# EAGLE design arcade_controls (EAGLE 6.4)
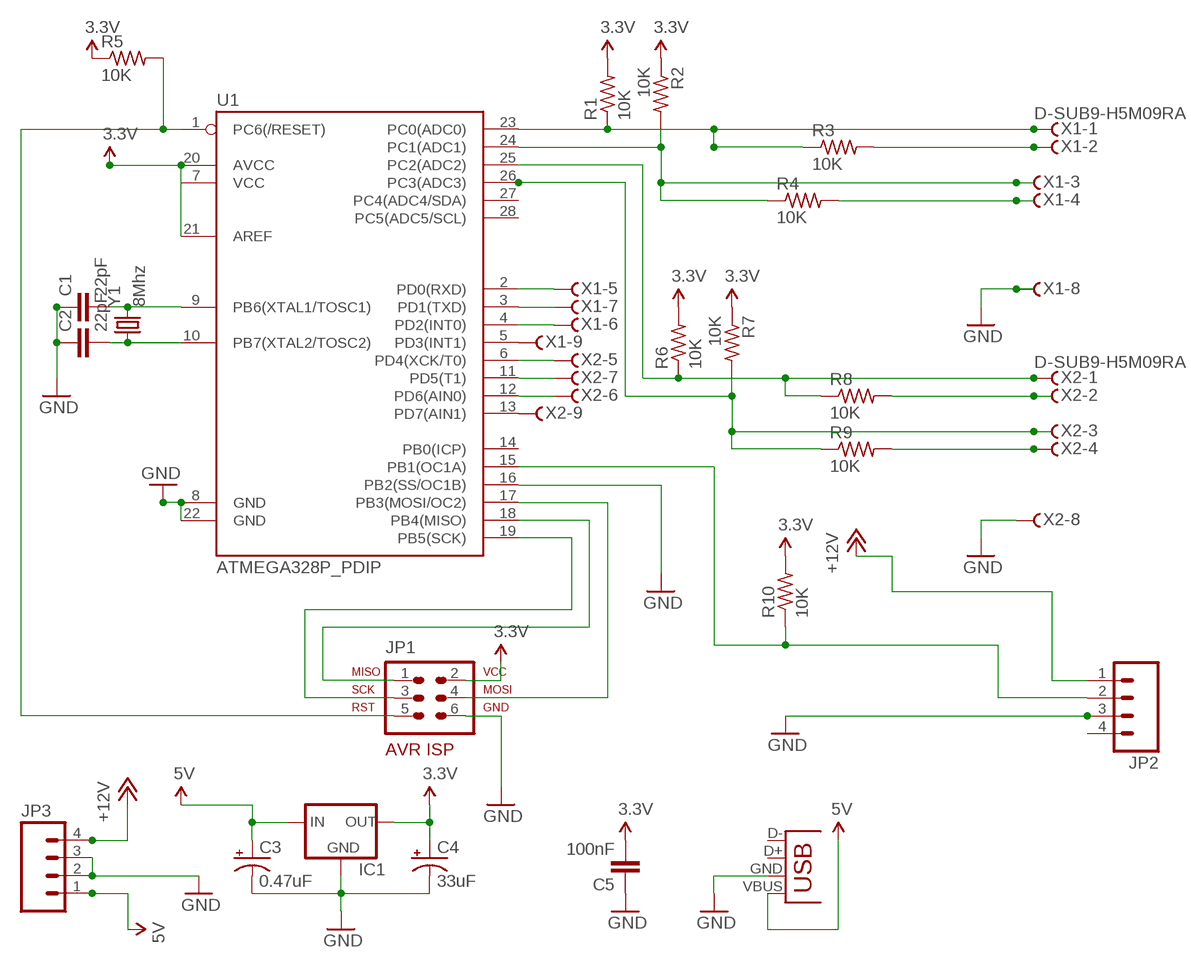
[diagram p0: schematic, sheet 1]

## Parts
C1  22pF  CAPPTH  [CAP-PTH-SMALL]
C2  22pF  CAPPTH  [CAP-PTH-SMALL]
C3  0.47uF  CAP_POLPTH2  [CPOL-RADIAL-10UF-25V]
C4  33uF  CAP_POLPTH2  [CPOL-RADIAL-10UF-25V]
C5  100nF  CAPPTH  [CAP-PTH-SMALL]
IC1  V_REG_78XXSIDE  [78XXL]
JP1  AVR-ISP-6VERT  [AVR-ISP-6]
JP2  M04LOCK  [1X04_LOCK]
JP3  M04LOCK  [1X04_LOCK]
JP4  USB-A-H  [USB-A-H]
R1  10K  R-US_0309/12  [0309/12]
R2  10K  R-US_0309/12  [0309/12]
R3  10K  R-US_0309/12  [0309/12]
R4  10K  R-US_0309/12  [0309/12]
R5  10K  R-US_0309/12  [0309/12]
R6  10K  R-US_0309/12  [0309/12]
R7  10K  R-US_0309/12  [0309/12]
R8  10K  R-US_0309/12  [0309/12]
R9  10K  R-US_0309/12  [0309/12]
R10  10K  R-US_0309/12  [0309/12]
U1  ATMEGA328P_PDIP  [DIL28-3]
X1  D-SUB9-H5M09RA  [H5M09RA]
X2  D-SUB9-H5M09RA  [H5M09RA]
Y1  8Mhz  CRYSTALHC49UV  [HC49U-V]

## Nets
3.3V: C4.1(+) C5.2 IC1.OUT JP1.2 R1.2 R2.1 R5.1 R6.2 R7.1 R10.2 U1.7(VCC) U1.20(AVCC) U1.21(AREF)
5V: C3.1(+) IC1.IN JP3.1 JP4.VBUS(GND)
+12V: JP2.1 JP3.4
GND: C1.1 C2.1 C3.2(-) C4.2(-) C5.1 IC1.GND JP1.6 JP2.3 JP3.2 JP3.3 JP4.GND(VBUS) U1.8(GND) U1.16(PB2(SS/OC1B)) U1.22(GND) X1.8 X2.8
N$1: R1.1 R3.1 U1.23(PC0(ADC0)) X1.1
N$2: U1.12(PD6(AIN0)) X2.6
N$3: JP1.5 R5.2 U1.1(PC6(/RESET))
N$4: R2.2 R4.1 U1.24(PC1(ADC1)) X1.3
N$5: JP1.3 U1.19(PB5(SCK))
N$6: JP1.1 U1.18(PB4(MISO))
N$7: JP1.4 U1.17(PB3(MOSI/OC2))
N$8: U1.13(PD7(AIN1)) X2.9
N$9: C2.2 U1.10(PB7(XTAL2/TOSC2)) Y1.1
N$10: JP2.2 R10.1 U1.15(PB1(OC1A))
N$11: U1.11(PD5(T1)) X2.7
N$12: R3.2 X1.2
N$13: R4.2 X1.4
N$14: U1.3(PD1(TXD)) X1.7
N$15: R7.2 R9.1 U1.26(PC3(ADC3)) X2.3
N$16: C1.2 U1.9(PB6(XTAL1/TOSC1)) Y1.2
N$17: R6.1 R8.1 U1.25(PC2(ADC2)) X2.1
N$18: R8.2 X2.2
N$19: R9.2 X2.4
N$20: U1.2(PD0(RXD)) X1.5
N$21: U1.4(PD2(INT0)) X1.6
N$23: U1.5(PD3(INT1)) X1.9
N$24: U1.6(PD4(XCK/T0)) X2.5
Unconnected: JP2.4 JP4.D+(D-) JP4.D-(D+) U1.14(PB0(ICP)) U1.27(PC4(ADC4/SDA)) U1.28(PC5(ADC5/SCL))

## Library data of the parts
C1 C2 C5 = SparkFun-Capacitors:CAP: Capacitor Standard 0603 ceramic capacitor, and 0.1" leaded capacitor.
C3 C4 = SparkFun-Capacitors:CAP_POL: Capacitor Polarized These are standard SMD and PTH capacitors. Normally 10uF, 47uF, and 100uF in electrolytic and tantalum varieties. Always verify the external diameter of the through hole cap, it varies with capacity, voltage, and manufacturer. The EIA devices should be standard.
IC1 = SparkFun-PowerIC:V_REG_78XX: Voltage Regulator Standard 7805 5V regulator. IGO (Input Ground Output). Spark Fun Electronics SKU : COM-00107
JP1 = avr-7:AVR-ISP-6: AVR ISP-6 Serial Programming Header
JP2 JP3 = SparkFun-Connectors:M04: Header 4 Standard 4-pin 0.1" header. Use with straight break away headers (SKU : PRT-00116), right angle break away headers (PRT-00553), swiss pins (PRT-00743), machine pins (PRT-00117), and female headers (PRT-00115). Molex polarized connector foot print use with SKU : PRT-08231 with associated crimp pins and housings. 1MM SMD Version SKU: PRT-10208
JP4 = SparkFun-Connectors:USB: USB Connectors USB-B-PTH is fully proven SKU : PRT-00139/CONN-08278 USB-miniB is fully proven SKU : PRT-00587 USB-A-PCB is untested. USB-A-H is throughly reviewed, but untested. Spark Fun Electronics SKU : PRT-00437 USB-B-SMT is throughly reviewed, but untested. Needs silkscreen touching up. USB-A-S has not been used/tested USB-MB-H has not been used/tested USB-MICROB has been used. CONN-09505
R1-R10 = resistor:R-US_: RESISTOR, American symbol
U1 = SparkFun-DigitalIC:ATMEGA328P_PDIP: uC used in the Arduino 32kb flash, 1k EEPROM, 2k SRAM This is the through-hole version of this chip.
X1 X2 = con-thomas-betts:D-SUB9-: D-Subminiatur Connector Source: Electronioc Interconnects European Edition 1998; OC_FARNELL: unknown; OC_NEWARK: unknown
Y1 = SparkFun-FreqCtrl:CRYSTAL: Various standard crystals. Proven footprints. Spark Fun Electronics SKU : COM-00534

## Board
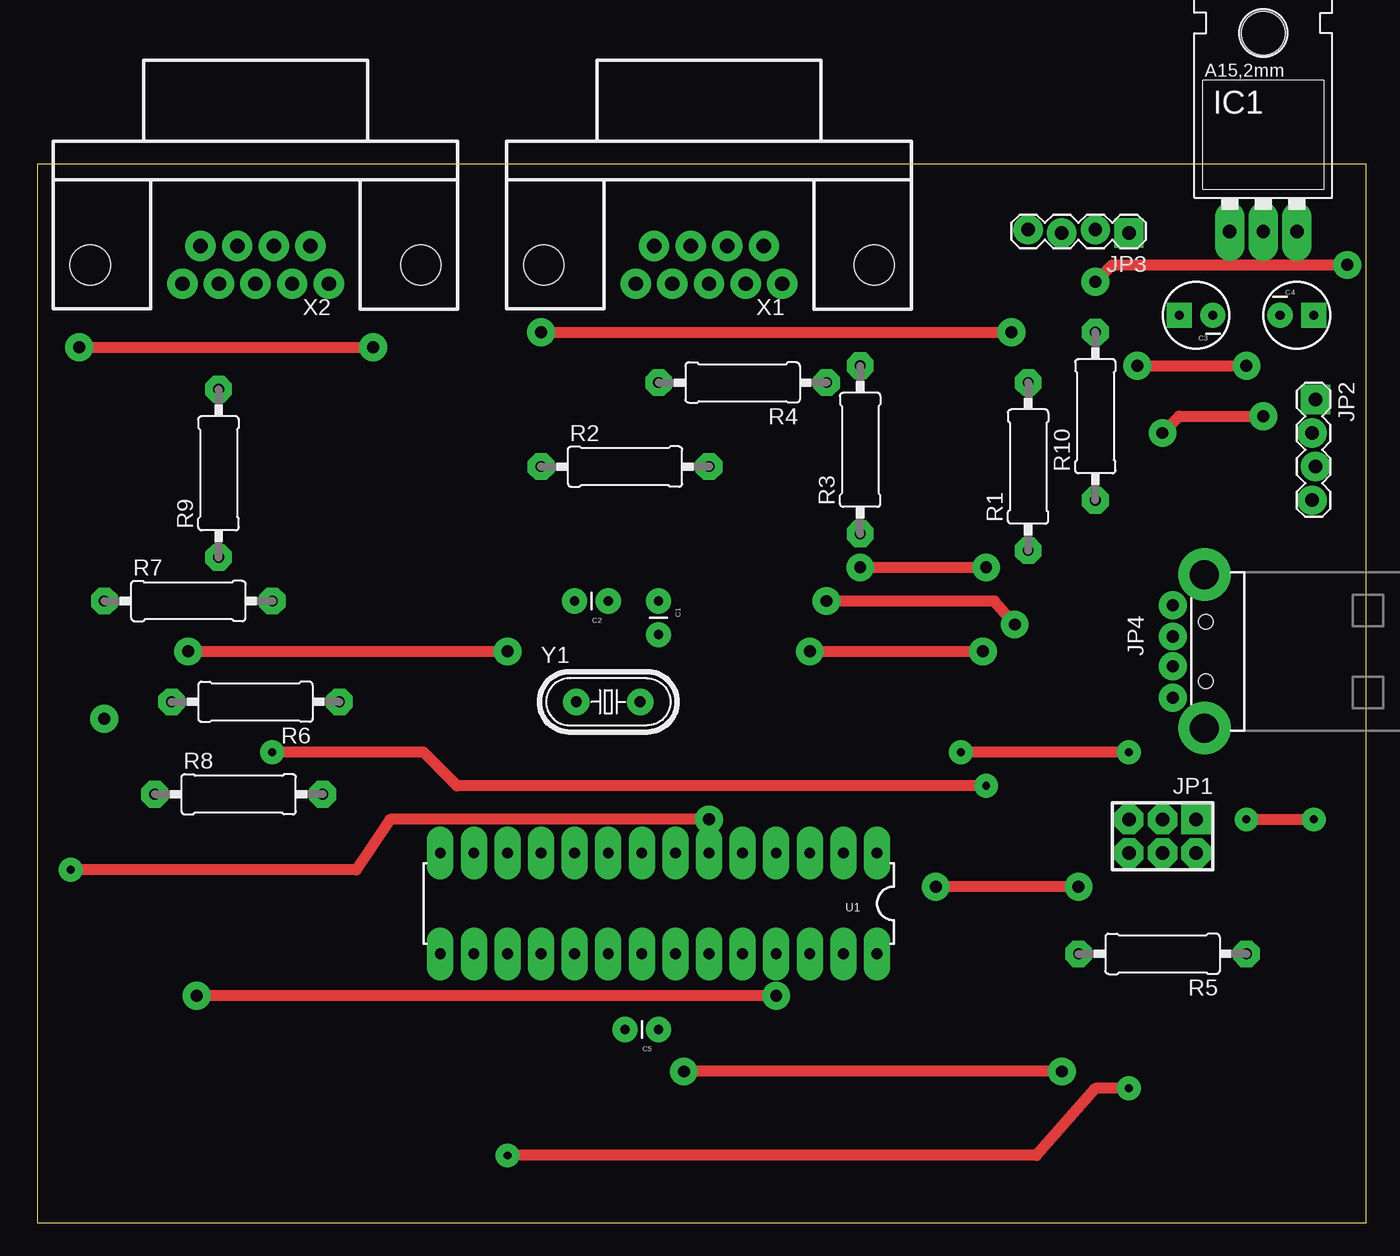
[diagram p1: board, top side]
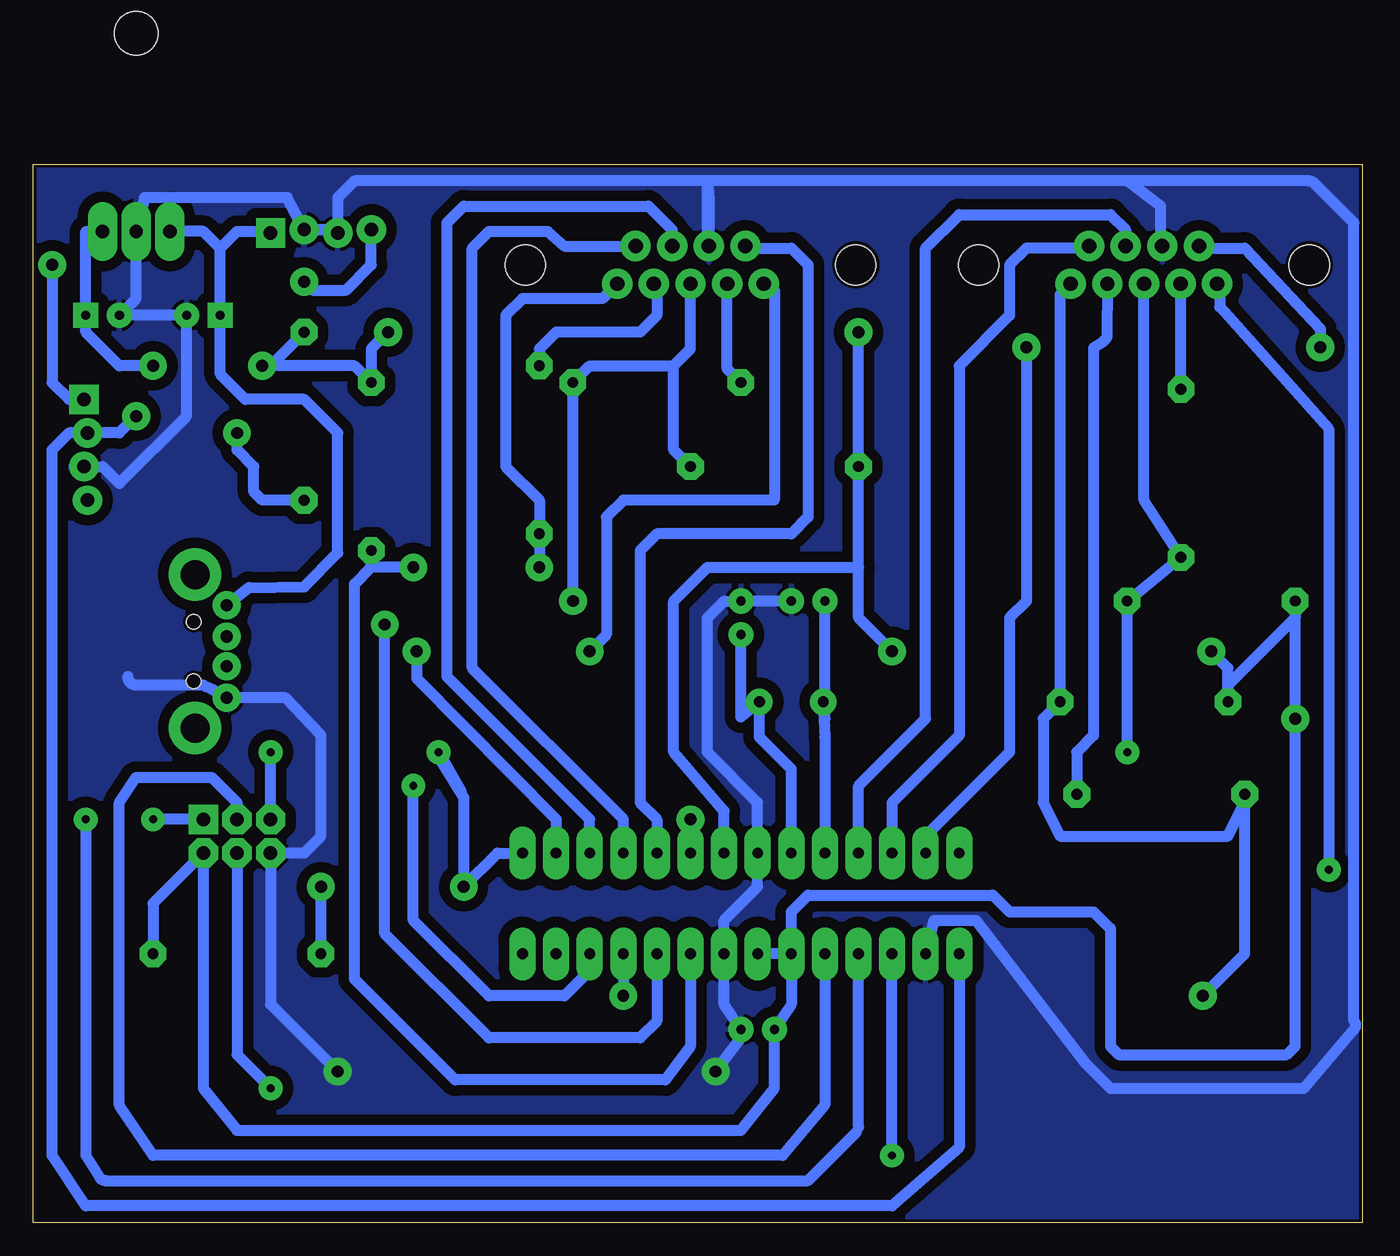
[diagram p2: board, bottom side, seen from below]

Size 100.51 x 80 mm. Coordinates in mm from the lower left corner, seen from the top.
Outline: 0,0 100.51,0 100.51,80 0,80 0,0
Copper layers (1*16): Top 0.035mm / dielectric 1.5mm / Bottom 0.035mm
Design rules "hobby": minimum track width 0.8mm, minimum drill 0.8mm, track to track 0.8mm, track to pad 0.8mm, pad to pad 0.45mm, via to via 0.8mm, smd to smd 8mil, copper to edge 10mil, drill to drill 8mil, minimum pad ring 0.6mm, minimum via ring 0.6mm, stop-mask expansion 0mil, vias tented up to drill 0mil, thermal gap 10mil

### Footprints (pad centres in the part's own frame; a part is rotated, then mirrored left to right if it is on the bottom)
CAP-PTH-SMALL = drill 0.7 pad 1.651: 1 0,0; 2 2.54,0
CPOL-RADIAL-10UF-25V = drill 0.7 pad 1.651 square: 1 1.27,0 | drill 0.7 pad 1.651: 2 -1.27,0
78XXL = drill 1.016 long: GND 0,-3.81; IN -2.54,-3.81; OUT 2.54,-3.81 | hole 3.302: 0,11.176
AVR-ISP-6 = drill 1.016 square: 1 -2.54,-1.27 | drill 1.016 octagon: 2 -2.54,1.27; 3 0,-1.27; 4 0,1.27; 5 2.54,-1.27; 6 2.54,1.27
1X04_LOCK = drill 1.016 pad 1.88 square: 1 0,0.127 | drill 1.016 pad 1.88: 2 2.54,-0.127; 3 5.08,0.127; 4 7.62,-0.127
USB-A-H = drill 0.914 pad 1.88: D+ 2.4,1.127; D- 2.4,-1.127; GND 2.4,3.5; VBUS 2.4,-3.5 | drill 2.2: GND2 0,-5.8; GND3 0,5.8 | hole 1.1: -0.1,2.25; -0.1,-2.25
0309/12 = drill 0.813 octagon: 1 -6.35,0; 2 6.35,0
DIL28-3 = drill 0.813 long: 1 -16.51,-3.81; 2 -13.97,-3.81; 3 -11.43,-3.81; 4 -8.89,-3.81; 5 -6.35,-3.81; 6 -3.81,-3.81; 7 -1.27,-3.81; 8 1.27,-3.81; 9 3.81,-3.81; 10 6.35,-3.81; 11 8.89,-3.81; 12 11.43,-3.81; 13 13.97,-3.81; 14 16.51,-3.81; 15 16.51,3.81; 16 13.97,3.81; 17 11.43,3.81; 18 8.89,3.81; 19 6.35,3.81; 20 3.81,3.81; 21 1.27,3.81; 22 -1.27,3.81; 23 -3.81,3.81; 24 -6.35,3.81; 25 -8.89,3.81; 26 -11.43,3.81; 27 -13.97,3.81; 28 -16.51,3.81
H5M09RA = drill 1.092: 1 -5.537,1.422; 2 -2.769,1.422; 3 0,1.422; 4 2.769,1.422; 5 5.537,1.422; 6 -4.153,-1.422; 7 -1.384,-1.422; 8 1.384,-1.422; 9 4.153,-1.422 | hole 3.048: -12.497,0; 12.497,0
HC49U-V = drill 0.813: 1 -2.413,0; 2 2.413,0

### Placement (x,y rotation side)
C1  46.99,46.99 270 top
C2  43.18,46.99 180 top
C3  87.63,68.58 180 top
C4  95.25,68.58 0 top
C5  46.99,14.61 180 top
IC1  92.71,78.74 0 top
JP1  85.09,29.21 180 top
JP2  96.52,62.23 270 top
JP3  82.55,74.93 180 top
JP4  88.27,43.18 180 top
R1  74.93,57.15 90 top
R2  44.45,57.15 0 top
R3  62.23,58.42 90 top
R4  53.34,63.5 180 top
R5  85.09,20.32 180 top
R6  16.51,39.37 180 top
R7  11.43,46.99 0 top
R8  15.24,32.38 0 top
R9  13.72,56.64 90 top
R10  80.01,60.96 90 top
U1  46.99,24.13 180 top
X1  50.8,72.39 180 top
X2  16.51,72.39 180 top
Y1  43.18,39.37 0 top

### Tracks (layer width: path | path; a pad name or v marks a point on that pad's centre or on a via)
3.3V  (via drill 0.9)
  Top 0.813: v11.43,43.18 v35.56,43.18 | v38.1,67.31 v73.66,67.31 | v83.19,64.77 v91.44,64.77
  Bottom 0.813: v11.43,43.18 10.16,41.91 R6.2 10.16,40.64 5.08,45.72 R7.1 v5.08,38.1 5.08,13.34 5.71,12.7 18.41,12.7 19.05,13.34 19.05,22.23 20.32,23.5 26.67,23.5 27.94,24.77 41.91,24.77 43.18,23.5 U1.20 | v35.56,43.18 38.1,45.72 38.1,49.53 | 38.1,49.53 R2.1 v38.1,67.31 | v73.66,67.31 74.93,66.04 R1.2 76.2,64.77 v83.19,64.77 82.55,64.77 R10.2 | IC1.OUT 96.52,74.93 C4.1 96.52,67.31 93.98,64.77 v91.44,64.77 | U1.7 48.26,31.11 52.07,35.56 52.07,46.99 49.53,49.53 38.1,49.53 | U1.20 43.18,16.51 C5.2 44.45,10.16 46.99,6.99 85.09,6.99 87.63,10.16 JP1.2 91.44,24.13 R5.1 | U1.20 U1.21
5V
  Bottom 0.813: 86.36,73.66 85.09,74.93 82.55,74.93 JP3.1 | 86.36,73.66 C3.1 86.36,64.14 84.45,62.23 80.01,62.23 77.47,59.69 77.47,50.63 80.01,48.06 84.2,48.01 JP4.VBUS | 86.36,73.66 87.63,74.93 IC1.IN
+12V  (via drill 0.9)
  Top 0.813: v80.01,71.12 81.28,72.39 v99.06,72.39
  Bottom 0.813: JP3.4 74.93,72.39 76.83,70.48 79.38,70.48 v80.01,71.12 | v99.06,72.39 99.06,63.5 97.79,62.23 JP2.1
GND  (via drill 0.9)
  Top 0.813: v77.47,11.43 v48.9,11.43
  Bottom 0.813: X2.8 15.24,73.93 15.24,76.84 17.78,78.74 | 17.78,78.74 49.53,78.74 | 49.53,78.74 49.42,77.36 X1.8 49.53,73.93 49.53,78.74 | JP4.GND 81.42,39.66 78.74,36.83 78.74,29.21 80.01,27.94 JP1.6 82.55,16.51 v77.47,11.43 | JP4.GND 85.56,39.37 | 49.53,78.74 76.2,78.74 77.47,77.47 JP3.3 77.72,75.06 JP3.2 | C2.1 C1.1 48.26,46.99 49.53,45.72 49.53,35.56 45.72,31.75 U1.8 45.72,25.4 48.26,22.86 U1.22 48.26,16.51 C5.1 46.99,13.97 v48.9,11.43 | JP3.2 80.01,74.93 | JP3.2 81.28,77.47 92.08,77.47 IC1.GND 92.71,69.85 C4.2 C3.2 88.9,60.96 93.98,55.88 95.25,57.15 JP2.3 | JP4.GND 87,40.31 87.63,40.64 92.71,40.64 arc90 93.34,41.27 | 17.78,78.74 4.07,78.74 arc45 3.62,78.55 0.64,75.56 0.64,15.24 arc90 0.64,14.61 4.45,10.16 19.05,10.16 20.95,12.07 29.21,22.86 32.38,22.86 U1.16
  pour Bottom: 0,80.01 0,0 100.33,0 100.33,80.01
N$1  (via drill 0.9)
  Top 0.813: v62.23,49.53 v71.75,49.53
  Bottom 0.813: X1.1 57.45,69.85 63.5,69.85 64.77,68.58 64.77,57.15 62.23,54.61 R3.1 v62.23,49.53 | v71.75,49.53 74.93,49.53 | U1.23 50.8,13.34 52.7,10.79 68.58,10.79 76.2,18.41 76.2,48.26 74.93,49.53 | 74.93,49.53 R1.1
N$2
  Bottom 0.813: X2.6 20.82,73.66 25.4,73.66 26.67,72.39 26.67,68.58 30.48,64.77 30.48,36.83 35.56,31.75 U1.12
N$3  (via drill 0.6, 0.9)
  Top 0.813: v78.74,25.4 v67.94,25.4 | v82.55,35.56 v69.85,35.56
  Bottom 0.813: R5.2 v78.74,25.4 | U1.1 65.41,27.94 v67.94,25.4 67.94,32.12 70.04,35.48 68.13,32.57 v69.85,35.56 | JP1.5 v82.55,35.56
N$4  (via drill 0.9)
  Top 0.813: v73.91,45.21 72.39,46.99 v59.69,46.99
  Bottom 0.813: 52.07,64.77 58.42,64.77 R4.1 v59.69,46.99 | 52.07,64.77 50.8,66.04 X1.3 | U1.24 53.34,15.24 54.61,13.97 66.04,13.97 73.91,21.84 v73.91,45.21 | R2.2 52.07,58.42 52.07,64.77
N$5
  Bottom 0.813: U1.19 40.64,8.89 43.81,5.08 91.44,5.08 93.98,8.89 93.98,31.75 92.71,33.65 87,33.65 85.09,31.75 JP1.3
N$6  (via drill 0.6)
  Top 0.813: v91.44,30.48 v96.52,30.48
  Bottom 0.406: 38.29,6.8 arc-45 38.1,7.25
  Bottom 0.813: JP1.1 v91.44,30.48 | v96.52,30.48 96.52,5.08 95.44,3.36 arc-45 94.99,3.18 41.91,3.18 38.29,6.8 | 38.1,7.25 U1.18
N$7  (via drill 0.6)
  Top 0.813: v82.55,10.16 80.01,10.16 75.56,5.08 v35.56,5.08
  Bottom 0.813: JP1.4 85.09,12.7 v82.55,10.16 | v35.56,5.08 U1.17
N$8  (via drill 0.9)
  Top 0.813: v3.17,66.17 v25.4,66.17
  Bottom 0.813: X2.9 12.21,73.66 8.89,73.66 3.17,67.56 v3.17,66.17 | v25.4,66.17 25.4,46.99 26.67,45.72 26.67,35.56 33.02,29.21 U1.13
N$9
  Bottom 0.813: U1.10 40.64,36.7 Y1.1 40.64,37.97 C2.2
N$10  (via drill 0.9)
  Top 0.813: v85.09,59.69 86.36,60.96 v92.71,60.96
  Bottom 0.813: v85.09,59.69 85.09,58.42 83.82,57.15 83.82,55.24 83.19,54.61 R10.1 | v92.71,60.96 93.98,59.69 JP2.2 97.79,59.69 99.06,58.42 99.06,5.08 96.52,1.27 35.56,1.27 30.48,5.71 U1.15
N$11
  Bottom 0.813: U1.11 38.1,33.02 33.02,38.1 33.02,73.66 30.48,76.2 19.05,76.2 17.89,75.04 X2.7
N$12
  Bottom 0.813: X1.2 53.34,70.74 53.34,68.58 54.61,67.31 60.96,67.31 62.23,66.04 R3.2
N$13
  Bottom 0.813: R4.2 48.03,64.54 X1.4
N$14
  Bottom 0.813: U1.3 58.42,30.48 69.22,41.27 69.22,75.56 67.94,76.84 53.98,76.84 52.18,75.04 X1.7
N$15  (via drill 0.6)
  Top 0.813: v71.75,33.02 31.75,33.02 29.21,35.56 v17.78,35.56
  Bottom 0.813: X2.3 16.51,54.61 R9.1 R7.2 v17.78,35.56 | U1.26 58.42,19.05 60.33,17.14 66.04,17.14 71.75,22.86 v71.75,33.02
N$16
  Bottom 0.813: U1.9 43.18,34.29 45.59,36.7 Y1.2 46.99,38.23 C1.2
N$17  (via drill 0.9)
  Top 0.813: v55.88,17.14 v12.06,17.14
  Bottom 0.813: X2.1 22.86,70.16 R6.1 24.13,38.1 24.13,31.75 22.86,29.21 10.16,29.21 8.89,31.75 | 8.89,31.75 R8.1 | U1.25 v55.88,17.14 | v12.06,17.14 8.89,20.32 8.89,31.75
N$18
  Bottom 0.813: X2.2 19.3,66.93 19.56,66.62 20.32,66.12 20.32,36.83 21.59,35.56 R8.2
N$19
  Bottom 0.813: R9.2 13.74,65 X2.4
N$20  (via drill 0.9)
  Top 0.813: v58.42,43.18 v71.5,43.18
  Bottom 0.813: X1.5 44.45,70.51 44.45,54.61 55.88,54.61 57.15,53.34 57.15,44.45 v58.42,43.18 | v71.5,43.18 71.5,41.15 60.96,30.48 U1.2
N$21
  Bottom 0.813: U1.4 55.88,30.48 67.31,41.91 67.31,73.66 66.04,74.93 61.59,74.93 60.33,73.81 X1.6
N$23
  Bottom 0.813: X1.9 46.49,73.66 43.18,73.66 41.91,72.39 41.91,53.34 43.18,52.07 53.34,52.07 54.61,50.8 54.61,31.75 53.34,30.48 U1.5
N$24  (via drill 0.6, 0.9)
  Top 0.813: v50.8,30.48 26.67,30.48 24.13,26.67 v2.54,26.67
  Bottom 0.813: X2.5 10.79,70.79 10.79,69.22 2.54,59.99 v2.54,26.67 | 50.8,26.67 U1.6 v50.8,30.48